# Altium schematic sheet Sheet4.SchDoc
size A4; Organization: Blinkinlabs, LLC
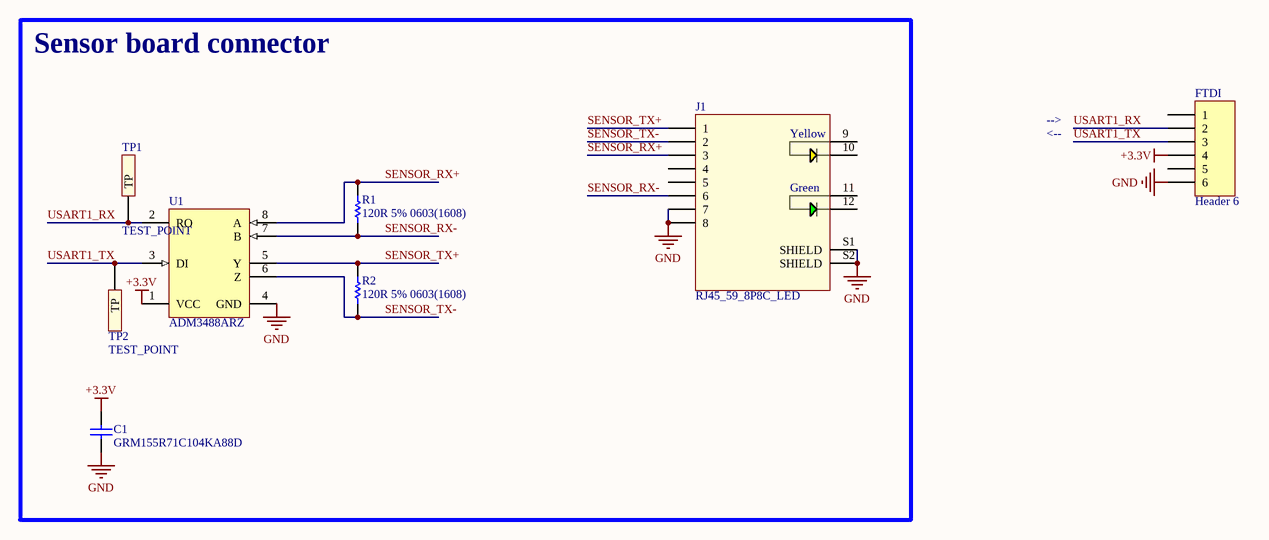
[diagram p0: Sheet4.SchDoc]

## Parts
C1  GRM155R71C104KA88D  [CAPC1005X55X25ML05T10]
FTDI  Header 6  [HDR1X6]
J1  RJ45_59_8P8C_LED  [RJ45_59_8P8C_LED]
R1  120R 5% 0603(1608)  [RESC0603(1608)_L]
R2  120R 5% 0603(1608)  [RESC0603(1608)_L]
TP1  TEST_POINT  [TP-SMD-1mm]  (no BOM)
TP2  TEST_POINT  [TP-SMD-1mm]  (no BOM)
U1  ADM3488ARZ  [ADI-R-8_L]

## Blocks framed on the sheet
Sensor board connector: C1 J1 R1 R2 TP1 TP2 U1

## Nets
+3.3V: C1.2 FTDI.4 U1.1(VCC)
GND: C1.1 FTDI.6 J1.7 J1.8 J1.S1(SHIELD) J1.S2(SHIELD) U1.4(GND)
SENSOR_RX+: J1.3 R1.2 U1.8(A)
SENSOR_RX-: J1.6 R1.1 U1.7(B)
SENSOR_TX+: J1.1 R2.2 U1.5(Y)
SENSOR_TX-: J1.2 R2.1 U1.6(Z)
USART1_RX: FTDI.2 TP1.1(TP) U1.2(RO)
USART1_TX: FTDI.3 TP2.1(TP) U1.3(DI)

Not connected (* = marked no-connect by the designer): FTDI 1 5; J1 4 5 9(Yellow_Anode) 10(Yellow_Cathode) 11(Green_Anode) 12(Green_Cathode)

## Notes on the sheet
- <--
- -->
- Title:
- Project:
- Revision:
- Date:
- Time:
- Sheet
- of
- (in symbol RJ45_59_8P8C_LED) Yellow; Green

## Library data of the parts
C1 = CMP-2100-03641-1: Chip Capacitor, 0.1 uF, +/- 10%, 16 V, -55 to 125 degC, 0402 (1005 Metric), RoHS, Tape and Reel; Manufacturer: Murata; Material: Ceramic; Insulation Resistance: 10GR; Voltage: 16V; Dielectric: X7R; Capacitance: 100nF; REACH SVHC: NoSVHC; Depth: 0.5mm; Case/Package: 0402; Datasheet URL: http://psearch.en.murata.com/capacitor/product/GRM155R71C104KA88%23.pdf; Lead Free: LeadFree; Dielectric Material: Ceramic; Manufacturer URL: http://www.murata.com/; Min Operating Temperature: -55degC; Length: 1mm; Case Code (Metric): 1005; Radiation Hardening: No; Package Reference: 0402; RoHSCompliant: true; Datasheet Version: 42675.0; Thickness: 0.022inch; Packaging: TapeandReel; Voltage Rating (DC): 16V; Tolerance: 10%; Max Operating Temperature: 125degC; Package Description: 2-Pin Surface Mount Device, Body 1 x 0.5 mm; Mount: SurfaceMount; Height: 0.5mm; Width: 0.5mm; Number of Pins: 2; Voltage Rating: 16V; Case Code (Imperial): 0402; Termination: SMD/SMT; Package Quantity: 1
FTDI = Header 6: Header, 6-Pin; LatestRevisionDate: 17-Jul-2002; LatestRevisionNote: Re-released for DXP Platform.; Publisher: Altium Limited
J1 = RJ45_59_8P8C_LED: Generic RJ49 jack with LED and without magnetics; Manufacturer: Unknown/Generic; PartNumber: RJ45_59_8P8C_LED
R1 R2 = CMP-1012-00052-1: 120R 0.1W 5% 0603 (1608 Metric)  SMD; Case-EIA: 0603; Value: 120.00 Ohm; Case-Metric: 1608; Technology: SMT; Power: 0.1 W; Tolerance: 5 %
TP1 TP2 = TEST_POINT: Test point
U1 = CMP-0535-00058-1: 3.3 V Slew Rate Limited, Full-Duplex, RS-485/RS-422 Transceivers, 3 to 3.6 V, -40 to 85 degC, 8-Pin SOIC (R-8), RoHS, Tube; Manufacturer: Analog Devices; Guaranteed Data Rate: 0.25 Mbps; Receiver Hysteresis: 50 mV; Number of Drivers: 1; Duplex: Full; ComponentLink2URL: http://www.analog.com/static/imported-files/data_sheets/ADM3483_3485_3488_3490_3491.pdf; Mounting Technology: Surface Mount; RoHS: TRUE; ComponentLink2Description: Datasheet; ComponentLink3URL: http://www.analog.com/media/en/package-pcb-resources/package/pkg_pdf/soic_narrow-r/r_8.pdf; ComponentLink3Description: Package Specification; DatasheetVersion: Rev. E; PackageDescription: 8-Pin Standard Small Outline Package, Body 4.9 x 3.9 mm, Pitch 1.27 mm; ComponentLink1Description: Manufacturer URL; Supply Voltage: 3 to 3.6 V; PackageVersion: 06/2006; PartNumber: ADM3488ARZ; Packing: Tube; ComponentLink1URL: http://www.analog.com/en/index.html; Temperature Range: -40 to 85 degC